# Altium schematic sheet mcu.SchDoc
size A4; SheetNumber: 3; SheetTotal: 5
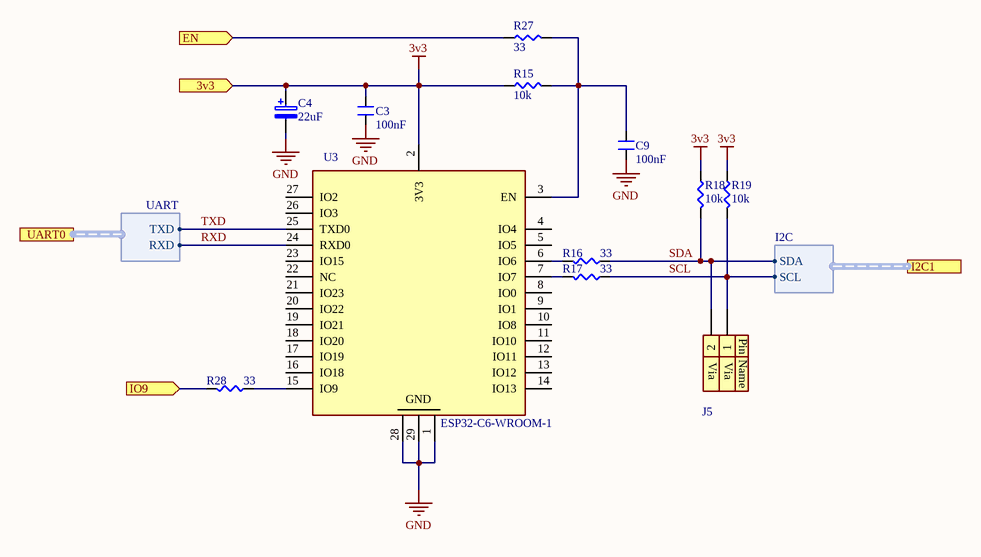
[diagram p0: mcu.SchDoc]

## Parts
C3  100nF  [CAP0603]
C4  22uF  [CAP TANT B]
C9  100nF  [CAP0603]
J5  M20-9990246  [FP-M20-9990246-MFG]  (value not drawn)
R15  10k  [RES0603]
R16  33  [RES0603]
R17  33  [RES0603]
R18  10k  [RES0603]
R19  10k  [RES0603]
R27  33  [RES0603]
R28  33  [RES0603]
U3  ESP32-C6-WROOM-1  [ESP32-C6-WROOM-1]

## Ports
3v3 (in), EN (in), I2C1 (harness I2C), IO9 (in), UART0 (harness UART)

## Harnesses
I2C: SDA, SCL
UART: TXD, RXD

## Nets
3v3: C3.2 C4.1 R15.2 R18.2 R19.2 U3.2(3V3) ; port 3v3
GND: C3.1 C4.2 C9.1 U3.1(GND) U3.28(GND) U3.29(GND)
EN: R27.2 ; port EN
IO9: R28.1 ; port IO9
RXD: U3.24(RXD0) ; port UART0.RXD
SCL: J5.1 R17.2 R19.1 ; port I2C1.SCL
SDA: J5.2 R16.2 R18.1 ; port I2C1.SDA
TXD: U3.25(TXD0) ; port UART0.TXD
NetC9_2: C9.2 R15.1 R27.1 U3.3(EN)
NetR16_1: R16.1 U3.6(IO6)
NetR17_1: R17.1 U3.7(IO7)
NetR28_2: R28.2 U3.15(IO9)

Not connected (* = marked no-connect by the designer): U3 4(IO4) 5(IO5) 8(IO0) 9(IO1) 10(IO8) 11(IO10) 12(IO11) 13(IO12) 14(IO13) 16(IO18) 17(IO19) 18(IO20) 19(IO21) 20(IO22) 21(IO23) 22(NC) 23(IO15) 26(IO3) 27(IO2)

## Notes on the sheet
- (in symbol M20-9990246) Pin; Via; Name

## Library data of the parts
C3 C9 = GCM188R71H104KA57J: Tolerance ±10% / Rated Voltage 50Vdc / Temperature 0±30ppm/℃; Manufacturer: Arrow Electronics; Item: 100nF 50V  ±10%; Vdc: 50V; Part Number: GCM188R71H104KA57J; Supplier 1: Mouser; Supplier Part Number 1: 81-GCM188R71H104KA7J; Case: 0603; Tolerance: 10%; Value: 100nF; HelpURL: http://www.farnell.com/datasheets/4360.pdf?src-supplier=Element14; Category: Multilayer Ceramic Capacitors - SMD/SMT
C4 = TAJB226K016RNJ: Tolerance ±10% / Type Molded / ESR (Equivalent Series Resistance) 2,3Ohm / Operating Temperature -55°C ~ 125°C; Manufacturer: KYOCERA AVX; Item: 22uF 16V ±10%; Vdc: 16V; Part Number: TAJB226K016RNJ; Supplier 1: Mouser; Supplier Part Number 1: 581-TAJB226K016; Case: Manufacturer Size Code B; Tolerance: 10%; Value: 22uF; HelpURL: https://eu.mouser.com/datasheet/2/40/TAJ-3165264.pdf; Category: Tantalum Capacitors - Solid SMD
J5 = M20-9990246: CONN HEADER VERT 2POS 2.54MM; Manufacturer: Harwin; Conn Gender: Male; Supplier 1: Digi-Key; Supplier Part Number 1: 952-2262-ND; Case: Male; Part Number: M20-9990246; Item: CMP-15831-000009-1; HelpURL: https://cdn.harwin.com/pdfs/M20-999.pdf?src-supplier=Element14
R15 R18 R19 = CR0603-FX-1002ELF: Tolerance ±1% / Power (Watts) 0.1W, 1/10W / Temperature Coefficient ±100ppm/°C; Manufacturer: Bourns; Item: 10k  ±1% 0.1W; Part Number: CR0603-FX-1002ELF; Supplier 1: Mouser; Supplier Part Number 1: 652-CR0603FX-1002ELF; Case: 0603; Tolerance: 1%; Value: 10k; HelpURL: https://eu.mouser.com/datasheet/2/54/cr-1858361.pdf; Category: Thin Film Resistors - SMD
R16 R17 R27 R28 = CR0603FX-33R0ELF: Tolerance ±1% / Power (Watts) 0.1W, 1/10W / Temperature Coefficient ±100ppm/°C; Manufacturer: Bourns; Item: 33  ±1% 0.1W; Part Number: CR0603FX-33R0ELF; Supplier 1: Mouser; Supplier Part Number 1: 652-CR0603FX-33R0ELF; Case: 0603; Tolerance: 1%; Value: 33; HelpURL: https://eu.mouser.com/datasheet/2/54/crxxxxx-1858361.pdf; Category: Thin Film Resistors - SMD
U3 = ESP32-C6-WROOM-1: ESP32-C6 module, Wi-Fi 6 in 2.4 GHz band, Bluetooth 5, Zigbee 3.0 and Thread. ESP34-WROOM Compatible; Manufacturer: Espressif Systems; Interfaces: GPIO, SPI, UART, I2C, I2S, RMT; Vdss: 3.3V; Part Number: ESP32-C6-WROOM-1; Item: ESP32-C6-WROOM-1; Supplier 1: Aliexpress; Supplier Part Number 1: ESP32-C6-WROOM-1; Case: Development Boards; HelpURL: https://www.espressif.com/sites/default/files/documentation/esp32-c6-wroom-1_wroom-1u_datasheet_en.pdf; Category: Multiprotocol Modules